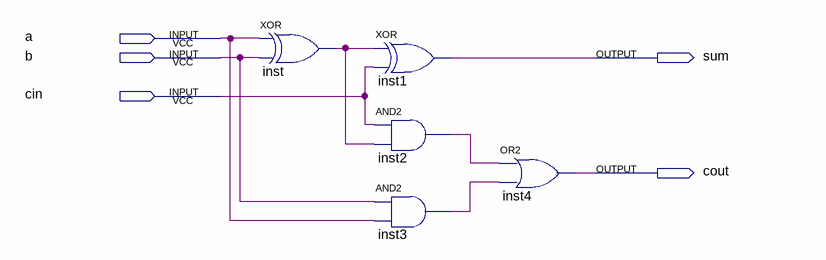
[diagram p0: schematic sheet]
// Quartus schematic 1bitfulladder.bdf as structural Verilog: 5 symbols, 5 pins
module \1bitfulladder  (
  input  a,
  input  b,
  input  cin,
  output sum,
  output cout
);

  wire inst2_out, inst3_out, inst_out;

  xor inst (inst_out, a, b);
  xor inst1 (sum, inst_out, cin);
  and inst2 (inst2_out, cin, inst_out);
  and inst3 (inst3_out, b, a);
  or inst4 (cout, inst2_out, inst3_out);
endmodule
